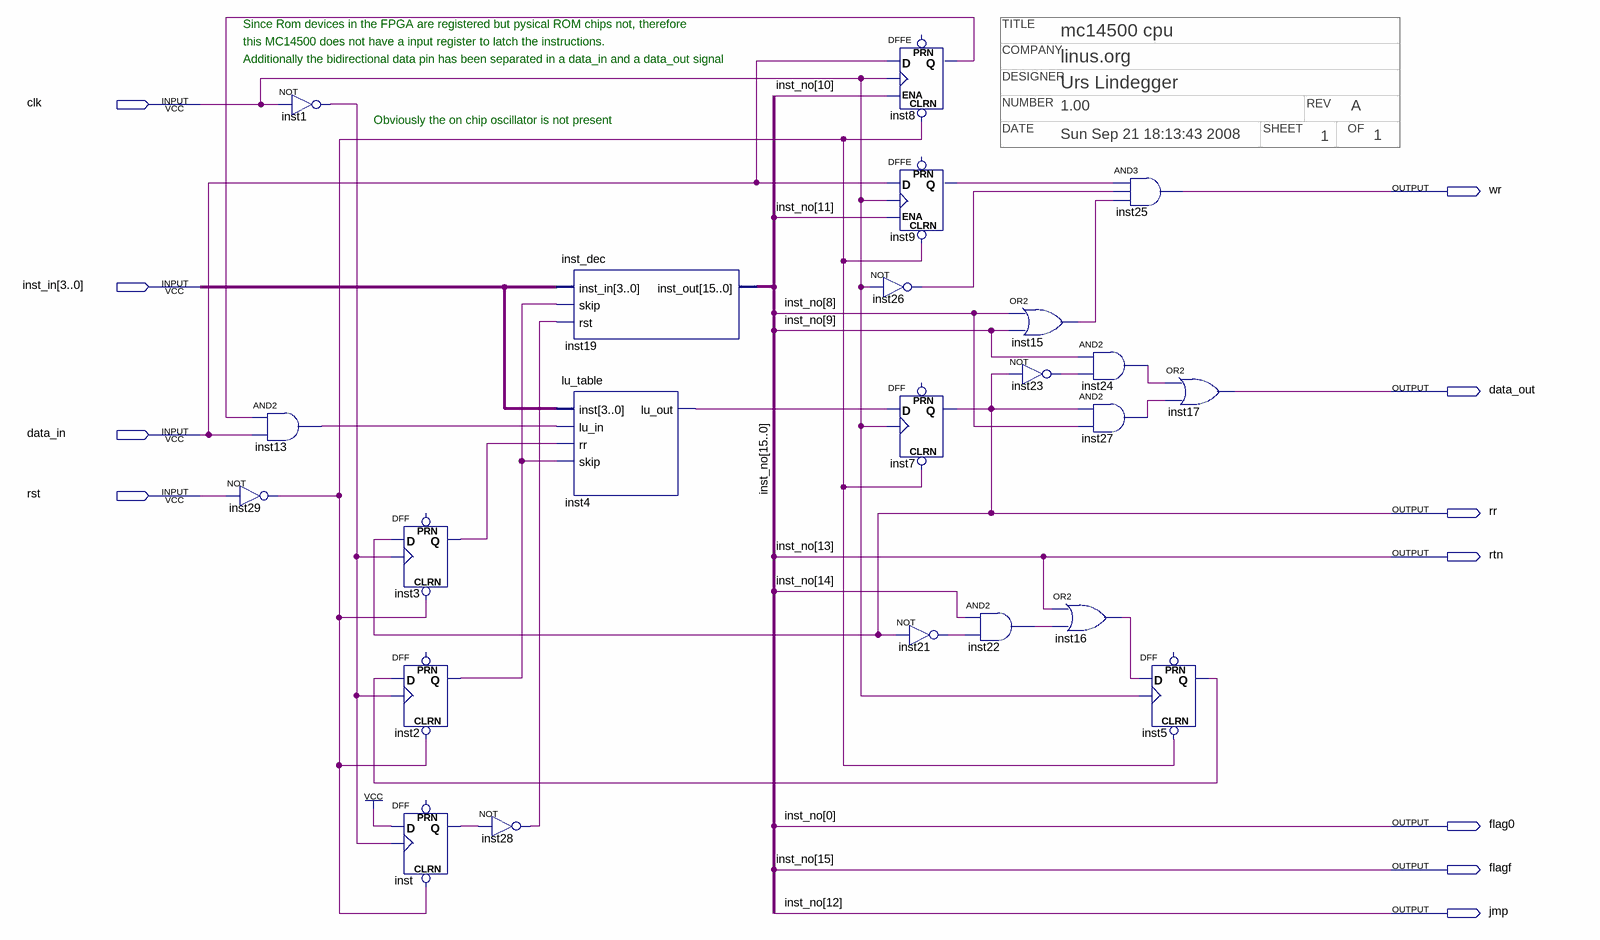
[diagram p0: schematic sheet]
// Quartus schematic mc14500.bdf as structural Verilog: 23 symbols, 11 pins
// Title block: TITLE: mc14500 cpu; COMPANY: linus.org; DESIGNER: Urs Lindegger; NUMBER: 1.00; REV: A; DATE: Sun Sep 21 18:13:43 2008; SHEET: 1; OF: 1
module mc14500 (
  input  clk,
  input  [3:0] inst_in,
  input  data_in,
  input  rst,
  output wr,
  output data_out,
  output rr,
  output rtn,
  output flag0,
  output flagf,
  output jmp
);

  wire inst1_out, inst2_q, inst3_q, inst4_lu_out, inst5_q, inst8_q, inst9_q, inst13_out, inst15_out,
       inst16_out, inst21_out, inst22_out, inst23_out, inst24_out, inst26_out, inst27_out, inst28_out,
       inst29_out, inst_q;
  wire [14:1] inst_no;

  not inst1 (inst1_out, clk);
  and inst13 (inst13_out, inst8_q, data_in);
  not inst29 (inst29_out, rst);
  DFF inst3 (.CLRN(inst29_out), .CLK(inst1_out), .D(rr), .Q(inst3_q));  // open: PRN
  DFF inst2 (.CLRN(inst29_out), .CLK(inst1_out), .D(inst5_q), .Q(inst2_q));  // open: PRN
  DFF inst (.CLRN(inst29_out), .CLK(inst1_out), .D(1'b1), .Q(inst_q));  // open: PRN
  not inst28 (inst28_out, inst_q);
  inst_dec inst19 (
    .inst_in(inst_in), .skip(inst2_q), .rst(inst28_out),
    .inst_out({flagf, inst_no[14], rtn, jmp, inst_no[11:1], flag0}));
  lu_table inst4 (.inst(inst_in), .lu_in(inst13_out), .rr(inst3_q), .skip(inst2_q), .lu_out(inst4_lu_out));
  DFFE inst8 (.CLRN(inst29_out), .D(data_in), .CLK(clk), .ENA(inst_no[10]), .Q(inst8_q));  // open: PRN
  DFFE inst9 (.CLRN(inst29_out), .D(data_in), .CLK(clk), .ENA(inst_no[11]), .Q(inst9_q));  // open: PRN
  not inst26 (inst26_out, clk);
  DFF inst7 (.CLRN(inst29_out), .CLK(clk), .D(inst4_lu_out), .Q(rr));  // open: PRN
  not inst21 (inst21_out, rr);
  and inst22 (inst22_out, inst_no[14], inst21_out);
  or inst15 (inst15_out, inst_no[8], inst_no[9]);
  not inst23 (inst23_out, rr);
  and inst25 (wr, inst9_q, inst26_out, inst15_out);
  and inst24 (inst24_out, inst_no[9], inst23_out);
  and inst27 (inst27_out, rr, inst_no[8]);
  or inst16 (inst16_out, rtn, inst22_out);
  or inst17 (data_out, inst24_out, inst27_out);
  DFF inst5 (.CLRN(inst29_out), .CLK(clk), .D(inst16_out), .Q(inst5_q));  // open: PRN

  // Other names for the same wires on the sheet: inst_no (some bits) = {flagf, rtn, jmp, flag0}

  // Notes on the sheet:
  //   Since Rom devices in the FPGA are registered but pysical ROM chips not, therefore
  //   this MC14500 does not have a input register to latch the instructions.
  //   Additionally the bidirectional data pin has been separated in a data_in and a data_out signal
  //   Obviously the on chip oscillator is not present
endmodule
